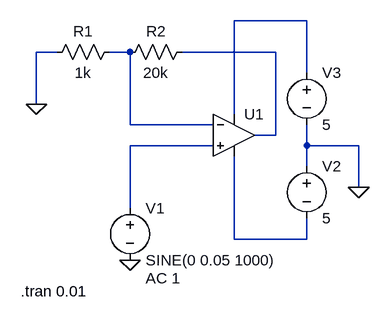
[diagram p0: schematic Livrable N°3 Circuit Ampli Op.asc]
Livrable N°3 Circuit Ampli Op.asc, the LTspice schematic file:
Version 4
SHEET 1 880 680
WIRE 336 -16 224 -16
WIRE -48 32 -80 32
WIRE 64 32 32 32
WIRE 288 32 144 32
WIRE 336 64 336 -16
WIRE -80 112 -80 32
WIRE 224 128 224 -16
WIRE 64 144 64 32
WIRE 192 144 64 144
WIRE 288 160 288 32
WIRE 288 160 256 160
WIRE 192 176 64 176
WIRE 336 176 336 144
WIRE 416 176 336 176
WIRE 336 208 336 176
WIRE 416 240 416 176
WIRE 64 272 64 176
WIRE 224 320 224 192
WIRE 336 320 336 288
WIRE 336 320 224 320
FLAG 64 352 0
FLAG -80 112 0
FLAG 416 240 0
SYMBOL OpAmps\\UniversalOpAmp 224 160 R0
SYMATTR InstName U1
SYMBOL voltage 64 256 R0
WINDOW 123 24 124 Left 2
WINDOW 39 0 0 Left 0
SYMATTR Value2 AC 1
SYMATTR InstName V1
SYMATTR Value SINE(0 0.05 1000)
SYMBOL res 48 16 R90
WINDOW 0 0 56 VBottom 2
WINDOW 3 32 56 VTop 2
SYMATTR InstName R1
SYMATTR Value 1k
SYMBOL res 160 16 R90
WINDOW 0 0 56 VBottom 2
WINDOW 3 32 56 VTop 2
SYMATTR InstName R2
SYMATTR Value 20k
SYMBOL voltage 336 192 R0
WINDOW 123 0 0 Left 0
WINDOW 39 0 0 Left 0
SYMATTR InstName V2
SYMATTR Value 5
SYMBOL voltage 336 48 R0
WINDOW 123 0 0 Left 0
WINDOW 39 0 0 Left 0
SYMATTR InstName V3
SYMATTR Value 5
TEXT -104 400 Left 2 !.tran 0.01

The netlist it stands for:
* Livrable N°3 Circuit Ampli Op.asc
XU1 N004 N002 N001 N005 N003 level1 Avol=1Meg GBW=10Meg Vos=0 En=0 Enk=0 In=0 Ink=0 Rin=500Meg  ; pins In+ In- V+ V- OUT
V1 N004 0 SINE(0 0.05 1000) AC 1
R1 N002 0 1k
R2 N003 N002 20k
V2 0 N005 5
V3 N001 0 5
.tran 0.01
.lib UniversalOpAmp1.lib
.backanno
.end